# Altium schematic sheet soldering.SchDoc
size A4
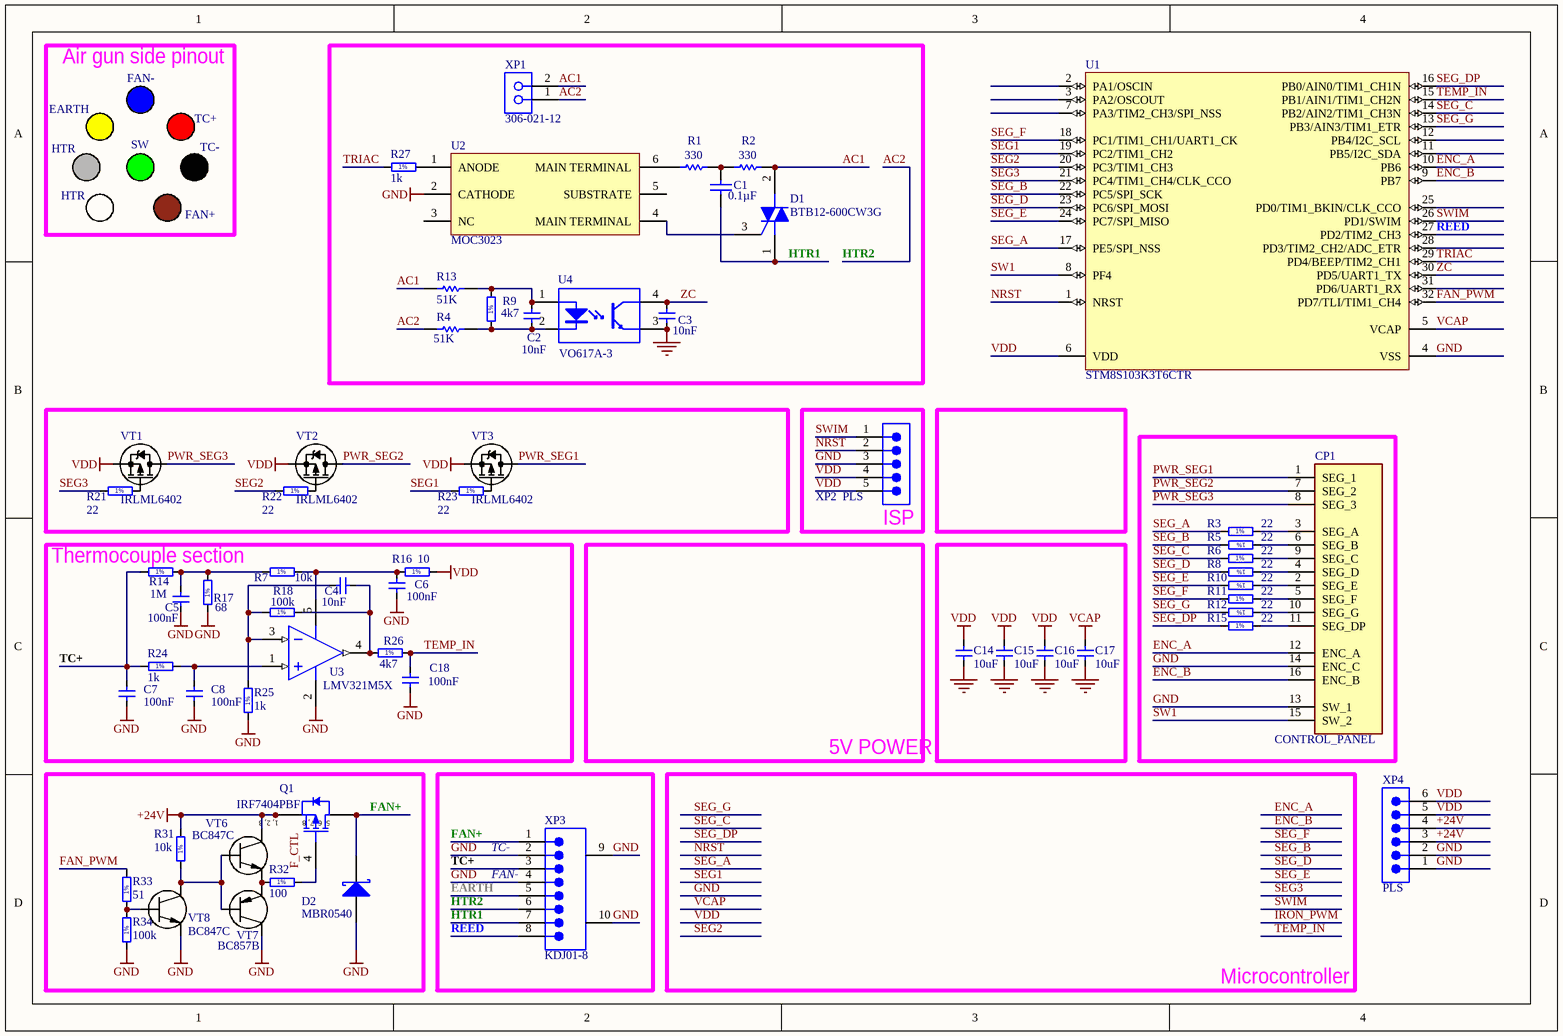
[diagram p0: soldering.SchDoc]

## Parts
C1  Capacitance: 0.1µF  [CAPA55-380X260]  (hidden comment: A104M15X7RF5TAA)
C2  10nF  [CAP0805R]
C3  10nF  [CAP0805R]
C4  10nF  [CAP0805R]
C5  100nF  [CAP0805R]
C6  100nF  [CAP0805R]
C7  100nF  [CAP0805R]
C8  100nF  [CAP0805R]
C14  10uF  [CAP0805R]
C15  10uF  [CAP0805R]
C16  10uF  [CAP0805R]
C17  10uF  [CAP0805R]
C18  100nF  [CAP0805R]
CP1  CONTROL_PANEL  [CONTROL_PANEL]
D1  BTB12-600CW3G  [ONSC-TO-220-3-221A-07]
D2  MBR0540  [FAIR-SOD123-2_V]
Q1  IRF7404PBF  [INF-SOIC-8_V]
R1  Resistance: 330  [RESA60-630X240]  (hidden comment: MFR-25FBF52-1K)
R2  Resistance: 330  [RESA60-630X240]  (hidden comment: MFR-25FBF52-1K)
R3  22  [RES0805R]
R4  Resistance: 51K  [RESA60-630X240]  (hidden comment: MFR-25FBF52-1K)
R5  22  [RES0805R]
R6  22  [RES0805R]
R7  10k  [RES0805R]
R8  22  [RES0805R]
R9  4k7  [RES0805R]
R10  22  [RES0805R]
R11  22  [RES0805R]
R12  22  [RES0805R]
R13  Resistance: 51K  [RESA60-630X240]  (hidden comment: MFR-25FBF52-1K)
R14  1M  [RES0805R]
R15  22  [RES0805R]
R16  10  [RES0805R]
R17  68  [RES0805R]
R18  100k  [RES0805R]
R21  22  [RES0805R]
R22  22  [RES0805R]
R23  22  [RES0805R]
R24  1k  [RES0805R]
R25  1k  [RES0805R]
R26  4k7  [RES0805R]
R27  1k  [RES0805R]
R31  10k  [RES0805R]
R32  100  [RES0805R]
R33  51  [RES0805R]
R34  100k  [RES0805R]
U1  STM8S103K3T6CTR  [STM-LQFP32_L]
U2  MOC3023  [LTST-DIP-6]
U3  LMV321M5X  [DBV0005A_N]
U4  VO617A-3  [VISH-DIP-4]
VT1  IRLML6402  [SOT23]
VT2  IRLML6402  [SOT23]
VT3  IRLML6402  [SOT23]
VT6  BC847C  [SOT23]
VT7  BC857B  [SOT23]
VT8  BC847C  [SOT23]
XP1  306-021-12  [306-021-12]
XP2  PLS  [PLS-05]
XP3  KDJ01-8  [KDJ01-8]
XP4  PLS  [PLS-06]

## Blocks framed on the sheet
ISP: XP2
Thermocouple section: C4-C8 C18 R7 R14 R16-R18 R24-R26 U3

## Nets
+24V: Q1.1(S) Q1.2(S) Q1.3(S) R31.2 VT6.3(C) XP4.3 XP4.4
GND: C3.1 C5.1 C6.1 C7.1 C8.1 C14.1 C15.1 C16.1 C17.1 C18.1 CP1.13(SW_1) CP1.14(ENC_C) D2.1(A) R17.1 R25.1 R34.1 U1.4(VSS) U2.2(CATHODE) U3.2(V-) U4.3(EMITTER) VT7.3(C) VT8.2(E) XP2.3 XP3.2 XP3.4 XP3.9 XP3.10 XP4.1 XP4.2
VCAP: C17.2 U1.5(VCAP)
VDD: C14.2 C15.2 C16.2 R16.2 U1.6(VDD) VT1.2(S) VT2.2(S) VT3.2(S) XP2.4 XP2.5 XP4.5 XP4.6
AC1: D1.2(MT2) R2.2 R13.1 XP1.2
AC2: R4.1 XP1.1 XP3.6  [also labelled HTR2]
EARTH: XP3.5
ENC_A: CP1.12(ENC_A) U1.10(PB6)
ENC_B: CP1.16(ENC_B) U1.9(PB7)
FAN+: D2.2(K) Q1.5(D) Q1.6(D) Q1.7(D) Q1.8(D) XP3.1
FAN_PWM: R33.2 U1.32(PD7/TLI/TIM1_CH4)
HTR1: C1.1 D1.1(MT1) XP3.7
NRST: U1.1(NRST) XP2.2
PWR_SEG1: CP1.1(SEG_1) VT3.3(D)
PWR_SEG2: CP1.7(SEG_2) VT2.3(D)
PWR_SEG3: CP1.8(SEG_3) VT1.3(D)
REED: U1.27(PD2/TIM2_CH3) XP3.8
SEG1: R23.1 U1.19(PC2/TIM1_CH2)
SEG2: R22.1 U1.20(PC3/TIM1_CH3)
SEG3: R21.1 U1.21(PC4/TIM1_CH4/CLK_CCO)
SEG_A: R3.1 U1.17(PE5/SPI_NSS)
SEG_B: R5.2 U1.22(PC5/SPI_SCK)
SEG_C: R6.1 U1.14(PB2/AIN2/TIM1_CH3N)
SEG_D: R8.2 U1.23(PC6/SPI_MOSI)
SEG_DP: R15.1 U1.16(PB0/AIN0/TIM1_CH1N)
SEG_E: R10.2 U1.24(PC7/SPI_MISO)
SEG_F: R11.1 U1.18(PC1/TIM1_CH1/UART1_CK)
SEG_G: R12.2 U1.13(PB3/AIN3/TIM1_ETR)
SW1: CP1.15(SW_2) U1.8(PF4)
SWIM: U1.26(PD1/SWIM) XP2.1
TC+: C7.2 R14.1 R24.1 XP3.3
TEMP_IN: C18.2 R26.2 U1.15(PB1/AIN1/TIM1_CH2N)
TRIAC: R27.1 U1.29(PD4/BEEP/TIM2_CH1)
ZC: C3.2 U1.30(PD5/UART1_TX) U4.4(COLLECTOR)
NetC1_2: C1.2 R1.2 R2.1
NetC2_1: C2.1 R4.2 R9.1 U4.2(CATHODE)
NetC2_2: C2.2 R9.2 R13.2 U4.1(ANODE)
NetC4_1: C4.1 R18.2 R26.1 U3.4(OUT)
NetC4_2: C4.2 R18.1 R25.2 U3.3(IN-)
NetC5_2: C5.2 R7.1 R14.2 R17.2
NetC6_2: C6.2 R7.2 R16.1 U3.5(V+)
NetC8_2: C8.2 R24.2 U3.1(IN+)
NetCP1_2: CP1.2(SEG_E) R10.1
NetCP1_3: CP1.3(SEG_A) R3.2
NetCP1_4: CP1.4(SEG_D) R8.1
NetCP1_5: CP1.5(SEG_F) R11.2
NetCP1_6: CP1.6(SEG_B) R5.1
NetCP1_9: CP1.9(SEG_C) R6.2
NetCP1_10: CP1.10(SEG_G) R12.1
NetCP1_11: CP1.11(SEG_DP) R15.2
NetD1_3: D1.3(G) U2.4(MAIN_TERMINAL)
NetQ1_4: Q1.4(G) R32.2
NetR1_1: R1.1 U2.6(MAIN_TERMINAL)
NetR21_2: R21.2 VT1.1(G)
NetR22_2: R22.2 VT2.1(G)
NetR23_2: R23.2 VT3.1(G)
NetR27_2: R27.2 U2.1(ANODE)
NetR31_1: R31.1 VT6.1(B) VT7.1(B) VT8.3(C)
NetR32_1: R32.1 VT6.2(E) VT7.2(E)
NetR33_1: R33.1 R34.2 VT8.1(B)

Not connected (* = marked no-connect by the designer): U1 2(PA1/OSCIN) 3(PA2/OSCOUT) 7(PA3/TIM2_CH3/SPI_NSS) 11(PB5/I2C_SDA) 12(PB4/I2C_SCL) 25(PD0/TIM1_BKIN/CLK_CCO) 28(PD3/TIM2_CH2/ADC_ETR) 31(PD6/UART1_RX); U2 3(NC) 5(SUBSTRATE)

## Notes on the sheet
- EARTH
- Air gun side pinout
- FAN-
- HTR
- SW
- TC+
- TC-
- FAN+
- 5V POWER
- (near XP3) TC-
- (near XP3) FAN-
- Microcontroller
- Labels drawn without touching a wire or pin: F_CTL
- (in symbol CMP-2000-06465-1) 1, 2, 3; 5, 6, 7, 8
- (in symbol R0805_1K_1%_0.125W_100PPM) 1%
- (in symbol R0805_1M_1%_0.125W_100PPM) 1%
- (in symbol R0805_4K7_1%_0.125W_100PPM) 1%
- (in symbol R0805_10K_1%_0.125W_100PPM) 1%
- (in symbol R0805_10R_1%_0.125W_200PPM) 1%
- (in symbol R0805_22R_1%_0.125W_100PPM) 1%
- (in symbol R0805_51R_1%_0.125W_100PPM) 1%
- (in symbol R0805_68R_1%_0.125W_100PPM) 1%
- (in symbol R0805_100K_1%_0.125W_100PPM) 1%
- (in symbol R0805_100R_1%_0.125W_100PPM) 1%

## Library data of the parts
C1 = CMP-2000-05716-1: Axial Leaded Multilayer Ceramic Capacitor for General Purpose, 50 VDC, 100 nF, +/- 20%, -55 to 125 degC, 2-Pin THD, RoHS, Tape and Reel; Manufacturer: Vishay; Voltage - Rated: 50V; Temperature Coefficient: X7R; Lead Spacing: -; Lead Style: -; Height - Seated (Max): -; Standard Package: 7,000; Datasheet Version: 08/2013; Datasheet URL: http://www.vishay.com/docs/45164/aseries.pdf; Package Description: 2-Pin Axial Lead, Dia 2.6 mm, Body Length 3.8 mm; Manufacturer URL: http://www.vishay.com/; Category: Capacitors; Mounting Technology: ThroughHole; Size / Dimension: 0.098"Diax0.150"L(2.50mmx3.80mm); Packaging: Tape&Reel(TR); Family: CeramicCapacitors; Applications: GeneralPurpose; Package Reference: CAPA55-380X260; Thickness (Max): -; Series: A; Features: -; Ratings: -; Mounting Type: ThroughHole; Operating Temperature: -55°C~125°C; Tolerance: ±20%; Package / Case: Axial
C2-C4 = CC0805_10NF_250V_10%_X7R: Part Description: SMD Multilayer Chip Ceramic Capacitor; Manufacturer: GENERIC; Manufacturer1 Part Number: C0805C103KARACTU; Voltage: 250V; TC: X7R; Tolerance: ±10%; Table: Capacitors SMD; Part Number: CC0805_10NF_250V_10%_X7R; Component Kind: Standard; Component Type: Standard; Pin Count: 2; Value: 10nF; Status: None; Manufacturer Part Number: CC0805_10NF_250V_10%_X7R; Case: 0805; Mounted: Yes; Socket: No; SMD: Yes; Manufacturer1 Example: KEMET; Manufacturer1 ComponentHeight: 0.88mm; HelpURL: \\cern.ch\dfs\Applications\Altium\Datasheets\CC0805_X7R_KEMET.pdf; Author: I. Kuznetsov; CreateDate: 6/24/2013; LatestRevisionDate: 6/24/2013; Manufacturer Part Number 2: CC0805KKX7RYBB103
C5-C8 C18 = CC0805_100NF_50V_10%_X7R: SMD 0805 Capacitor; Part Description: SMD Multilayer Chip Ceramic Capacitor; Manufacturer: GENERIC; Manufacturer1 Part Number: B37941K5104K62; Voltage: 50V; TC: X7R; Tolerance: ±10%; Table: Capacitors SMD; Part Number: CC0805_100NF_50V_10%_X7R; Component Kind: Standard; Component Type: Standard; Pin Count: 2; Value: 100nF; Status: Preferred; Manufacturer Part Number: CC0805_100NF_50V_10%_X7R; Case: 0805; Mounted: Yes; Socket: No; SMD: Yes; Manufacturer1 Example: EPCOS; Manufacturer1 ComponentHeight: 1.35mm; HelpURL: \\cern.ch\dfs\Applications\Altium\Datasheets\CC0805_X7R_EPCOS.pdf; Author: I. Kuznetsov; CreateDate: 03.12.2007; LatestRevisionDate: 03.12.2007
C14-C17 = CC0805_10UF_10V_10%_X7R: SMD 0805 Capacitor; Part Description: SMD Multilayer Chip Ceramic Capacitor; Manufacturer: GENERIC; Manufacturer1 Part Number: GRM21BR71A106KE51L; Voltage: 10V; TC: X7R; Tolerance: ±10%; Table: Capacitors SMD; Part Number: CC0805_10UF_10V_10%_X7R; Component Kind: Standard; Component Type: Standard; Pin Count: 2; Value: 10uF; Status: Preferred; Manufacturer Part Number: CC0805_10UF_10V_10%_X7R; Case: 0805; Mounted: Yes; Socket: No; SMD: Yes; Manufacturer1 Example: MURATA; Manufacturer1 ComponentHeight: 1.35mm; HelpURL: \\cern.ch\dfs\Applications\Altium\Datasheets\CC0805_X7R_MURATA.pdf; Author: I. Kuznetsov; CreateDate: 30.04.2012; LatestRevisionDate: 30.04.2012
D1 = CMP-1070-00036-1: Triacs, Silicon Bidirectional Thyristor, 3-Pin TO-220, Pb-Free, Tube; Manufacturer: On Semiconductor; IT(RMS) Max (A): 12; ITSM Max (A): 120; IGT Max (mA): 35; PackageDescription: 3-Pin Flange Mount, Vertical Straight Lead, Body 9.97 x 4.445 mm, Pitch 2.54 mm; ComponentLink2Description: Datasheet; PartNumber: BTB12-600CW3G; ComponentLink2URL: http://www.onsemi.com/pub_link/Collateral/BTB12-600CW3-D.PDF; ComponentLink3Description: Package Specification; Packing: Tube; ComponentLink3URL: http://www.onsemi.com/pub_link/Collateral/221A-07.PDF; ComponentLink1Description: Manufacturer URL; Mounting Technology: Through Hole; RoHS: Pb-Free; PackageVersion: Rev. O, 07/2008; DatasheetVersion: Rev. 1; ComponentLink1URL: http://www.onsemi.com/; PackageReference: TO-220-3-221A-07
D2 = CMP-2000-05114-1: Schottky Rectifier, 40 V, 0.5 A, 2-Pin SOD-123, RoHS, Tape and Reel; Manufacturer: Fairchild; Speed: FastRecovery=200mA(Io); Voltage - DC Reverse (Vr) (Max): 40V; Online Catalog: SchottkyDiode; Voltage - Forward (Vf) (Max) @ If: 510mV@500mA; Current - Reverse Leakage @ Vr: 20µA@40V; Current - Average Rectified (Io): 500mA; Other Names: MBR0540CT; Series: -; Category: DiscreteSemiconductorProducts; Datasheet URL: https://datasheet.ciiva.com/8303/mbr0540-8303808.pdf; Operating Temperature - Junction: -65degC~125degC; Manufacturer URL: https://www.fairchildsemi.com/; Family: Diodes,Rectifiers-Single; Mounting Type: SurfaceMount; Standard Package: 1; Diode Type: Schottky; Supplier Device Package: SOD-123; Reverse Recovery Time (trr): -; Package / Case: SOD-123; Datasheet Version: Rev. 1.1.0, 10/2014; Capacitance @ Vr, F: -; Packaging: CutTape(CT)
Q1 = CMP-2000-06465-1: HEXFET(R) Power MOSFET, 6.7 A, 20 V, 8-Pin SOIC, RoHS, Tape and Reel; Manufacturer: InfineonTechnologies; Vgs(th) (Max) @ Id: 700mV@250µA; Current - Continuous Drain (Id) @ 25°C: 6.7A(Ta); Gate Charge (Qg) @ Vgs: 50nC@4.5V; FET Feature: Standard; Input Capacitance (Ciss) @ Vds: 1500pF@15V; FET Type: MOSFETP-Channel,MetalOxide; Rds On (Max) @ Id, Vgs: 40mOhm@3.2A,4.5V; Power - Max: 2.5W; Drain to Source Voltage (Vdss): 20V; Package Reference: SOIC-8; Mounting Type: SurfaceMount; Datasheet Version: 09/2004; Family: Transistors-FETs,MOSFETs-Single; Package / Case: 8-SOIC(0.154",3.90mmWidth); Category: DiscreteSemiconductorProducts; Mounting Technology: SurfaceMount; Packaging: Tube; Package Description: 8-Pin Small Outline Integrated Circuit, Body 4.9 x 3.9 mm, Pitch 1.27 mm; Part Status: NotForNewDesigns; Operating Temperature: -55°C~150°C(TJ); Supplier Device Package: 8-SO; Series: HEXFET®; Manufacturer URL: http://www.infineon.com/; Datasheet URL: http://www.infineon.com/dgdl/irf7404pbf.pdf?fileId=5546d462533600a4015355fa31be1ba0
R1 R2 R4 R13 = CMP-1659-00075-1: Axial Resistor, 1 KOhm, +/- 1%, 250 mW, -55 to 155 degC, 2-Pin THD, RoHS, Bulk; Voltage Rating: 250 V; Power Rating: 250 mW; ComponentLink2Description: Datasheet; RoHSCompliant: true; PackageReference: MFR-25; Case\Package: Axial; Max Operating Temperature: 155 degC; DatasheetVersion: Apr-13; Tolerance: 1%; ComponentLink1URL: http://www.yageo.com/; Length: 0.248 inch; ComponentLink2URL: http://www.yageo.com/documents/recent/Yageo%20LR_MFR_2013.pdf; Packaging: Bulk; Package Quantity: 200; PackageDescription: 2-Pin Axial Lead, Dia 2.4 mm, Body Length 6.3 mm; Min Operating Temperature: -55 degC; ComponentLink1Description: Manufacturer URL
R3 R5 R6 R8 R10-R12 R15 R21-R23 = R0805_22R_1%_0.125W_100PPM: Part Description: General Purpose Thick Film Chip Resistor; Manufacturer: GENERIC; Manufacturer1 Part Number: NRC10F22R0TRF; Power: 0.125W; TC: ±100ppm/°C; Tolerance: ±1%; Table: Resistors SMD; Part Number: R0805_22R_1%_0.125W_100PPM; Component Kind: Standard; Component Type: Standard; Footprint: RESC2012X60N; Pin Count: 2; Value: 22; Status: Preferred; Manufacturer Part Number: R0805_22R_1%_0.125W_100PPM; Case: 0805; Mounted: Yes; Socket: No; SMD: Yes; Manufacturer1 Example: NIC COMPONENT; Manufacturer1 ComponentHeight: 0.6mm; HelpURL: \\cern.ch\dfs\Applications\Altium\Datasheets\R0805_NIC_NRC.pdf; Author: CERN DEM JLC; CreateDate: 03.12.2007; LatestRevisionDate: 13.03.2008
R7 R31 = R0805_10K_1%_0.125W_100PPM: Part Description: General Purpose Thick Film Chip Resistor; Manufacturer: GENERIC; Manufacturer1 Part Number: NRC10F1002TRF; Power: 0.125W; TC: ±100ppm/°C; Tolerance: ±1%; Table: Resistors SMD; Part Number: R0805_10K_1%_0.125W_100PPM; Component Kind: Standard; Component Type: Standard; Footprint: RESC2012X60N; Pin Count: 2; Value: 10k; Status: Preferred; Manufacturer Part Number: R0805_10K_1%_0.125W_100PPM; Case: 0805; Mounted: Yes; Socket: No; SMD: Yes; Manufacturer1 Example: NIC COMPONENT; Manufacturer1 ComponentHeight: 0.6mm; HelpURL: \\cern.ch\dfs\Applications\Altium\Datasheets\R0805_NIC_NRC.pdf; Author: CERN DEM JLC
  R7: CreateDate: 12/3/2007; LatestRevisionDate: 3/13/2008; PackageDescription: Standard
  R31: CreateDate: 03.12.2007; LatestRevisionDate: 13.03.2008
R9 R26 = R0805_4K7_1%_0.125W_100PPM: Part Description: General Purpose Thick Film Chip Resistor; Manufacturer: GENERIC; Manufacturer1 Part Number: NRC10F4701TRF; Power: 0.125W; TC: ±100ppm/°C; Tolerance: ±1%; Table: Resistors SMD; Part Number: R0805_4K7_1%_0.125W_100PPM; Component Kind: Standard; Component Type: Standard; Footprint: RESC2012X60N; Pin Count: 2; Value: 4k7; Status: Preferred; Manufacturer Part Number: R0805_4K7_1%_0.125W_100PPM; Case: 0805; Mounted: Yes; Socket: No; SMD: Yes; Manufacturer1 Example: NIC COMPONENT; Manufacturer1 ComponentHeight: 0.6mm; HelpURL: \\cern.ch\dfs\Applications\Altium\Datasheets\R0805_NIC_NRC.pdf; Author: CERN DEM JLC; CreateDate: 12/3/2007; LatestRevisionDate: 3/13/2008; PackageDescription: Standard
R14 = R0805_1M_1%_0.125W_100PPM: Part Description: General Purpose Thick Film Chip Resistor; Manufacturer: GENERIC; Manufacturer1 Part Number: NRC10F1004TRF; Power: 0.125W; TC: ±100ppm/°C; Tolerance: ±1%; Table: Resistors SMD; Part Number: R0805_1M_1%_0.125W_100PPM; Component Kind: Standard; Component Type: Standard; Footprint: RESC2012X60N; PackageDescription: Standard; Pin Count: 2; Value: 1M; Status: Preferred; Manufacturer Part Number: R0805_1M_1%_0.125W_100PPM; Case: 0805; Mounted: Yes; Socket: No; SMD: Yes; Manufacturer1 Example: NIC COMPONENT; Manufacturer1 ComponentHeight: 0.6mm; HelpURL: \\cern.ch\dfs\Applications\Altium\Datasheets\R0805_NIC_NRC.pdf; Author: CERN DEM JLC; CreateDate: 12/3/2007; LatestRevisionDate: 3/13/2008
R16 = R0805_10R_1%_0.125W_200PPM: Part Description: General Purpose Thick Film Chip Resistor; Manufacturer: GENERIC; Manufacturer1 Part Number: NRC10F10R0TRF; Power: 0.125W; TC: ±200ppm/°C; Tolerance: ±1%; Table: Resistors SMD; Part Number: R0805_10R_1%_0.125W_200PPM; Component Kind: Standard; Component Type: Standard; Footprint: RESC2012X60N; PackageDescription: Standard; Pin Count: 2; Value: 10; Status: Preferred; Manufacturer Part Number: R0805_10R_1%_0.125W_200PPM; Case: 0805; Mounted: Yes; Socket: No; SMD: Yes; Manufacturer1 Example: NIC COMPONENT; Manufacturer1 ComponentHeight: 0.6mm; HelpURL: \\cern.ch\dfs\Applications\Altium\Datasheets\R0805_NIC_NRC.pdf; Author: CERN DEM JLC; CreateDate: 12/3/2007; LatestRevisionDate: 6/24/2009
R17 = R0805_68R_1%_0.125W_100PPM: Part Description: General Purpose Thick Film Chip Resistor; Manufacturer: GENERIC; Manufacturer1 Part Number: NRC10F68R0TRF; Power: 0.125W; TC: ±100ppm/°C; Tolerance: ±1%; Table: Resistors SMD; Part Number: R0805_68R_1%_0.125W_100PPM; Component Kind: Standard; Component Type: Standard; Footprint: RESC2012X60N; PackageDescription: Standard; Pin Count: 2; Value: 68; Status: Preferred; Manufacturer Part Number: R0805_68R_1%_0.125W_100PPM; Case: 0805; Mounted: Yes; Socket: No; SMD: Yes; Manufacturer1 Example: NIC COMPONENT; Manufacturer1 ComponentHeight: 0.6mm; HelpURL: \\cern.ch\dfs\Applications\Altium\Datasheets\R0805_NIC_NRC.pdf; Author: CERN DEM JLC; CreateDate: 12/3/2007; LatestRevisionDate: 3/13/2008
R18 R34 = R0805_100K_1%_0.125W_100PPM: Part Description: General Purpose Thick Film Chip Resistor; Manufacturer: GENERIC; Manufacturer1 Part Number: NRC10F1003TRF; Power: 0.125W; TC: ±100ppm/°C; Tolerance: ±1%; Table: Resistors SMD; Part Number: R0805_100K_1%_0.125W_100PPM; Component Kind: Standard; Component Type: Standard; Footprint: RESC2012X60N; Pin Count: 2; Value: 100k; Status: Preferred; Manufacturer Part Number: R0805_100K_1%_0.125W_100PPM; Case: 0805; Mounted: Yes; Socket: No; SMD: Yes; Manufacturer1 Example: NIC COMPONENT; Manufacturer1 ComponentHeight: 0.6mm; HelpURL: \\cern.ch\dfs\Applications\Altium\Datasheets\R0805_NIC_NRC.pdf; Author: CERN DEM JLC
  R18: PackageDescription: Standard; CreateDate: 12/3/2007; LatestRevisionDate: 3/13/2008
  R34: CreateDate: 03.12.2007; LatestRevisionDate: 13.03.2008
R24 R25 R27 = R0805_1K_1%_0.125W_100PPM: Part Description: General Purpose Thick Film Chip Resistor; Manufacturer: GENERIC; Manufacturer1 Part Number: NRC10F1001TRF; Power: 0.125W; TC: ±100ppm/°C; Tolerance: ±1%; Table: Resistors SMD; Part Number: R0805_1K_1%_0.125W_100PPM; Component Kind: Standard; Component Type: Standard; Footprint: RESC2012X60N; Pin Count: 2; Value: 1k; Status: Preferred; Manufacturer Part Number: R0805_1K_1%_0.125W_100PPM; Case: 0805; Mounted: Yes; Socket: No; SMD: Yes; Manufacturer1 Example: NIC COMPONENT; Manufacturer1 ComponentHeight: 0.6mm; HelpURL: \\cern.ch\dfs\Applications\Altium\Datasheets\R0805_NIC_NRC.pdf; Author: CERN DEM JLC; CreateDate: 12/3/2007; LatestRevisionDate: 3/13/2008; PackageDescription: Standard
R32 = R0805_100R_1%_0.125W_100PPM: Part Description: General Purpose Thick Film Chip Resistor; Manufacturer: GENERIC; Manufacturer1 Part Number: NRC10F4700TRF; Power: 0.125W; TC: ±100ppm/°C; Tolerance: ±1%; Table: Resistors SMD; Part Number: R0805_100R_1%_0.125W_100PPM; Component Kind: Standard; Component Type: Standard; Footprint: RESC2012X60N; Pin Count: 2; Value: 100; Status: Preferred; Manufacturer Part Number: R0805_100R_1%_0.125W_100PPM; Case: 0805; Mounted: Yes; Socket: No; SMD: Yes; Manufacturer1 Example: NIC COMPONENT; Manufacturer1 ComponentHeight: 0.6mm; HelpURL: \\cern.ch\dfs\Applications\Altium\Datasheets\R0805_NIC_NRC.pdf; Author: CERN DEM JLC; CreateDate: 03.12.2007; LatestRevisionDate: 13.03.2008
R33 = R0805_51R_1%_0.125W_100PPM: Part Description: General Purpose Thick Film Chip Resistor; Manufacturer: GENERIC; Manufacturer1 Part Number: NRC10F51R0TRF; Power: 0.125W; TC: ±100ppm/°C; Tolerance: ±1%; Table: Resistors SMD; Part Number: R0805_51R_1%_0.125W_100PPM; Component Kind: Standard; Component Type: Standard; Footprint: RESC2012X60N; Pin Count: 2; Value: 51; Status: Preferred; Manufacturer Part Number: R0805_51R_1%_0.125W_100PPM; Case: 0805; Mounted: Yes; Socket: No; SMD: Yes; Manufacturer1 Example: NIC COMPONENT; Manufacturer1 ComponentHeight: 0.6mm; HelpURL: \\cern.ch\dfs\Applications\Altium\Datasheets\R0805_NIC_NRC.pdf; Author: CERN DEM JLC; CreateDate: 03.12.2007; LatestRevisionDate: 13.03.2008
U1 = CMP-0947-00001-1: STM8S 8-bit MCU, 8 kB Flash, 1 kB Internal RAM, -40 to 85 degC, 32-Pin LQFP, Tape and Reel; Manufacturer: STMicroelectronics; Sub-family Type: 103; Family Type: Standard; Internal RAM Size: 1 KBytes; Program Memory Size: 8 KBytes; Data E2PROM Nom: 640 Bytes; Product Class: STM8; Supply Voltage: 2.95 to 5.5 V; Operating Frequency: 16 MHz; Mounting Technology: Surface Mount; ComponentLink1Description: Manufacturer URL; PackageDescription: 32-Pin Low Profile Quad Flat Package, Body 7 x 7 mm, Pitch 0.8 mm; Packing: Tape and Reel; ComponentLink2Description: Datasheet; PartNumber: STM8S103K3T6CTR; PackageReference: LQFP-32; ComponentLink1URL: http://www.st.com/; Temperature Range: -40 to 85 degC; ComponentLink2URL: http://www.st.com/st-web-ui/static/active/en/resource/technical/document/datasheet/CD00226640.pdf; DatasheetVersion: Rev. 9
U2 = CMP-2000-06746-1: Optocoupler Triac, 50 mA, -40 to 100 degC, 6-Pin DIP, RoHS, Tube; Manufacturer: Lite-On-Inc.; Current - Hold (Ih): 400µA(Typ); Zero Crossing Circuit: Yes; Current - DC Forward (If) (Max): 50mA; Voltage - Off State: 600V; Voltage - Isolation: 5000Vrms; Approvals: CSA,FIMKO,UL; Current - LED Trigger (Ift) (Max): 5mA; Voltage - Forward (Vf) (Typ): 1.2V; Static dV/dt (Min): 1kV/µs; Number of Channels: 1; Category: Isolators; Family: Optoisolators-Triac,SCROutput; Supplier Device Package: 6-DIP; Datasheet URL: http://optoelectronics.liteon.com/upload/download/DS70-2001-026/S_110_MOC3063%20SERIES.pdf; Package Reference: DIP-6; Package / Case: 6-DIP(0.300",7.62mm); Mounting Technology: ThroughHole; Packaging: Tube; Mounting Type: ThroughHole; Operating Temperature: -40°C~100°C; Datasheet Version: Rev. C, 04/2010; Manufacturer URL: http://www.us.liteon.com/; Package Description: 6-Pin Double In-line Package, Body 7.3 x 6.5 mm, Pitch 2.54 mm; Output Type: Triac; Current - On State (It (RMS)) (Max): -; Series: -; Turn On Time: -
U3 = CMP-0055-01048-3: General Purpose, Low Voltage, Rail-to-Rail Output Operational Amplifiers, 5-pin SOT-23; Manufacturer: Texas Instruments; PackageTopMarking: A13*XTT; PowerWise: N; Package Reference: DBV0005A; PackageDescription: Molded SOT-23, .115 x .063 x .040 in Body, 5 Lead, .0375 in Pitch; CompType: Amplifiers; RoHS: N; ComponentLink1URL: http://www.ti.com/general/docs/lit/getliterature.tsp?genericPartNumber=LMV321-N&fileType=pdf; PinCount: 5; ComponentLink1Description: Datasheet URL
U4 = CMP-2000-07400-1: Optocoupler, Phototransistor Output, High Reliability, 5300 VRMS, -55 to 110 degC, 4-Pin DIP, RoHS, Tape and Reel; Manufacturer: Vishay/Semiconductor; Maximum Current Transfer Ratio @ Current: 200%; Maximum Input Current: 60mA; Maximum Collector Current: 50mA; Maximum Collector Emitter Voltage: 80V; Output Type: DC; Typical Forward Voltage: 1.35V; Rad Hard: No; Maximum Reverse Voltage: 6V; Minimum Forward Voltage: 1V; Maximum Forward Voltage: 1.65V; Number of Channels per Chip: 1; Minimum Isolation Voltage: 5000Vrms; Maximum Collector Emitter Saturation Voltage: 400mV; Maximum Power Dissipation: 150mW; Mounting Technology: ThroughHole; Packaging: Tape&Reel; Package Reference: DIP-4; Datasheet URL: http://www.vishay.com/docs/83430/vo617a.pdf; Package: 4PDIP; Input Type: DC; Package Description: 4-Pin Double In-line Package, Body 4.58 x 6.5 mm, Pitch 2.54 mm; Manufacturer URL: http://www.vishay.com/; Operating Temperature: -55to110°C; Category: TransistorandPhotovoltaicOutputPhotoCouplers; Datasheet Version: Rev. 2.5, 08/2015
VT1-VT3 = IRLML6402: Part Description: MOSFET P-канал 20В/3.7А/1.3Вт/0.065 Ом; Table: Transistors; Part Number: IRLML6402; Component Kind: Standard; Component Type: Standard; Device: IRLML6402; Status: Active; Case: SOT23; Mounted: Yes; Socket: No; SMD: Yes; Author: I. Kuznetsov
VT6 VT8 = BC847C: Part Description: NPN 45В/0.1А Кус.=420-800; Table: Transistors; Part Number: BC847C; Component Kind: Standard; Component Type: Standard; Device: BC847C; Status: Active; Case: SOT23; Mounted: Yes; Socket: No; SMD: Yes; Author: I. Kuznetsov
VT7 = BC857B: Part Description: PNP 45В/0.1А Кус.=200-450; Table: Transistors; Part Number: BC857B; Component Kind: Standard; Component Type: Standard; Device: BC857B; Status: Active; Case: SOT23; Mounted: Yes; Socket: No; SMD: Yes; Author: I. Kuznetsov
XP1 = 306-021-12: Table: DEGSON; Part Number: 306-021-12; Family: DG306; Device: 306-021-12; ComponentLink1URL: http://www.promelec.ru/pdf/305,306.pdf
XP2 = PLS-05: Manufacturer: AUK; Part Number: PLS-05; Component Kind: Standard; Component Type: Standard; PackageDescription: PLS-05; Pin Count: 5; Family: PLS; SMD: Yes; Manufacturer Part Number: PLS-05; Table: AUK
XP3 = KDJ01-8: Table: OTHER; Part Number: KDJ01-8; Device: KDJ01-8
XP4 = PLS-06: Manufacturer: AUK; Part Number: PLS-06; Component Kind: Standard; Component Type: Standard; PackageDescription: PLS-06; Pin Count: 6; Family: PLS; SMD: Yes; Device: PLS-06; Manufacturer Part Number: PLS-06; ComponentLink1URL: http://lib.chipdip.ru/227/DOC000227157.pdf; Table: AUK